# EAGLE design 6_Layer_sample (EAGLE 9.6.2)
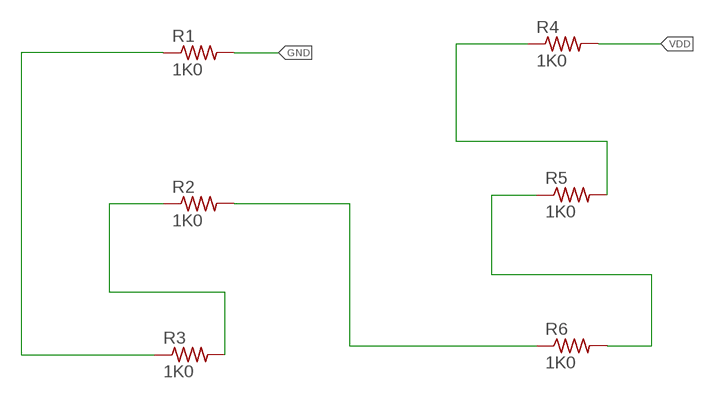
[diagram p0: schematic, sheet 1]

## Parts
R1  1K0  R_0402_1K0  [0402]
R2  1K0  R_0402_1K0  [0402]
R3  1K0  R_0402_1K0  [0402]
R4  1K0  R_0402_1K0  [0402]
R5  1K0  R_0402_1K0  [0402]
R6  1K0  R_0402_1K0  [0402]

## Nets
GND: R1.P$2
N$1: R1.P$1 R3.P$1
N$2: R2.P$1 R3.P$2
N$3: R2.P$2 R6.P$1
N$4: R5.P$1 R6.P$2
N$5: R4.P$1 R5.P$2
VDD: R4.P$2

## Library data of the parts
R1-R6 = 3D_MIG_Controller:R_0402_1K0; PARTNO: CRG0402J1K0

## Board
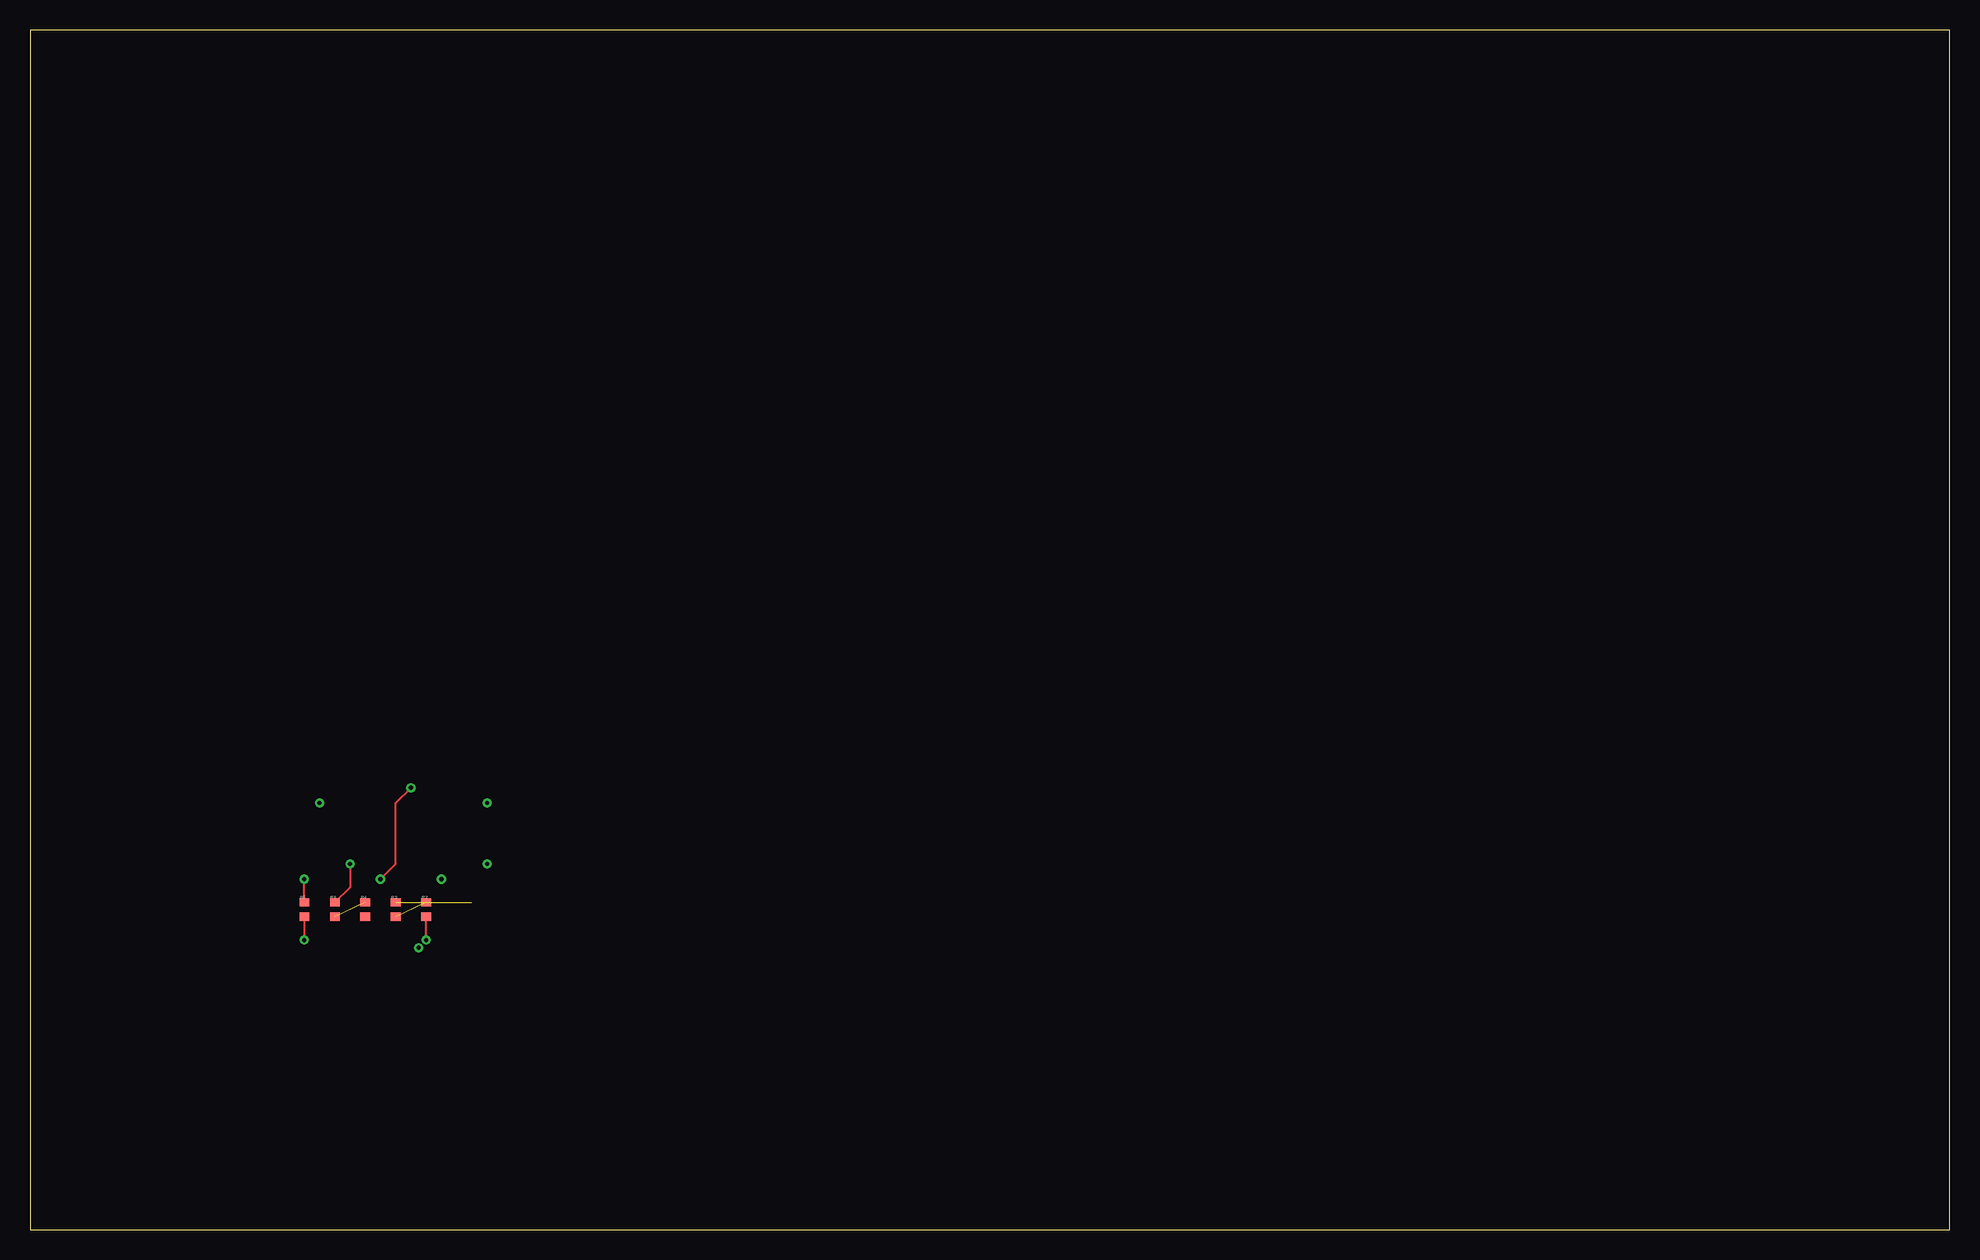
[diagram p1: board, top side]
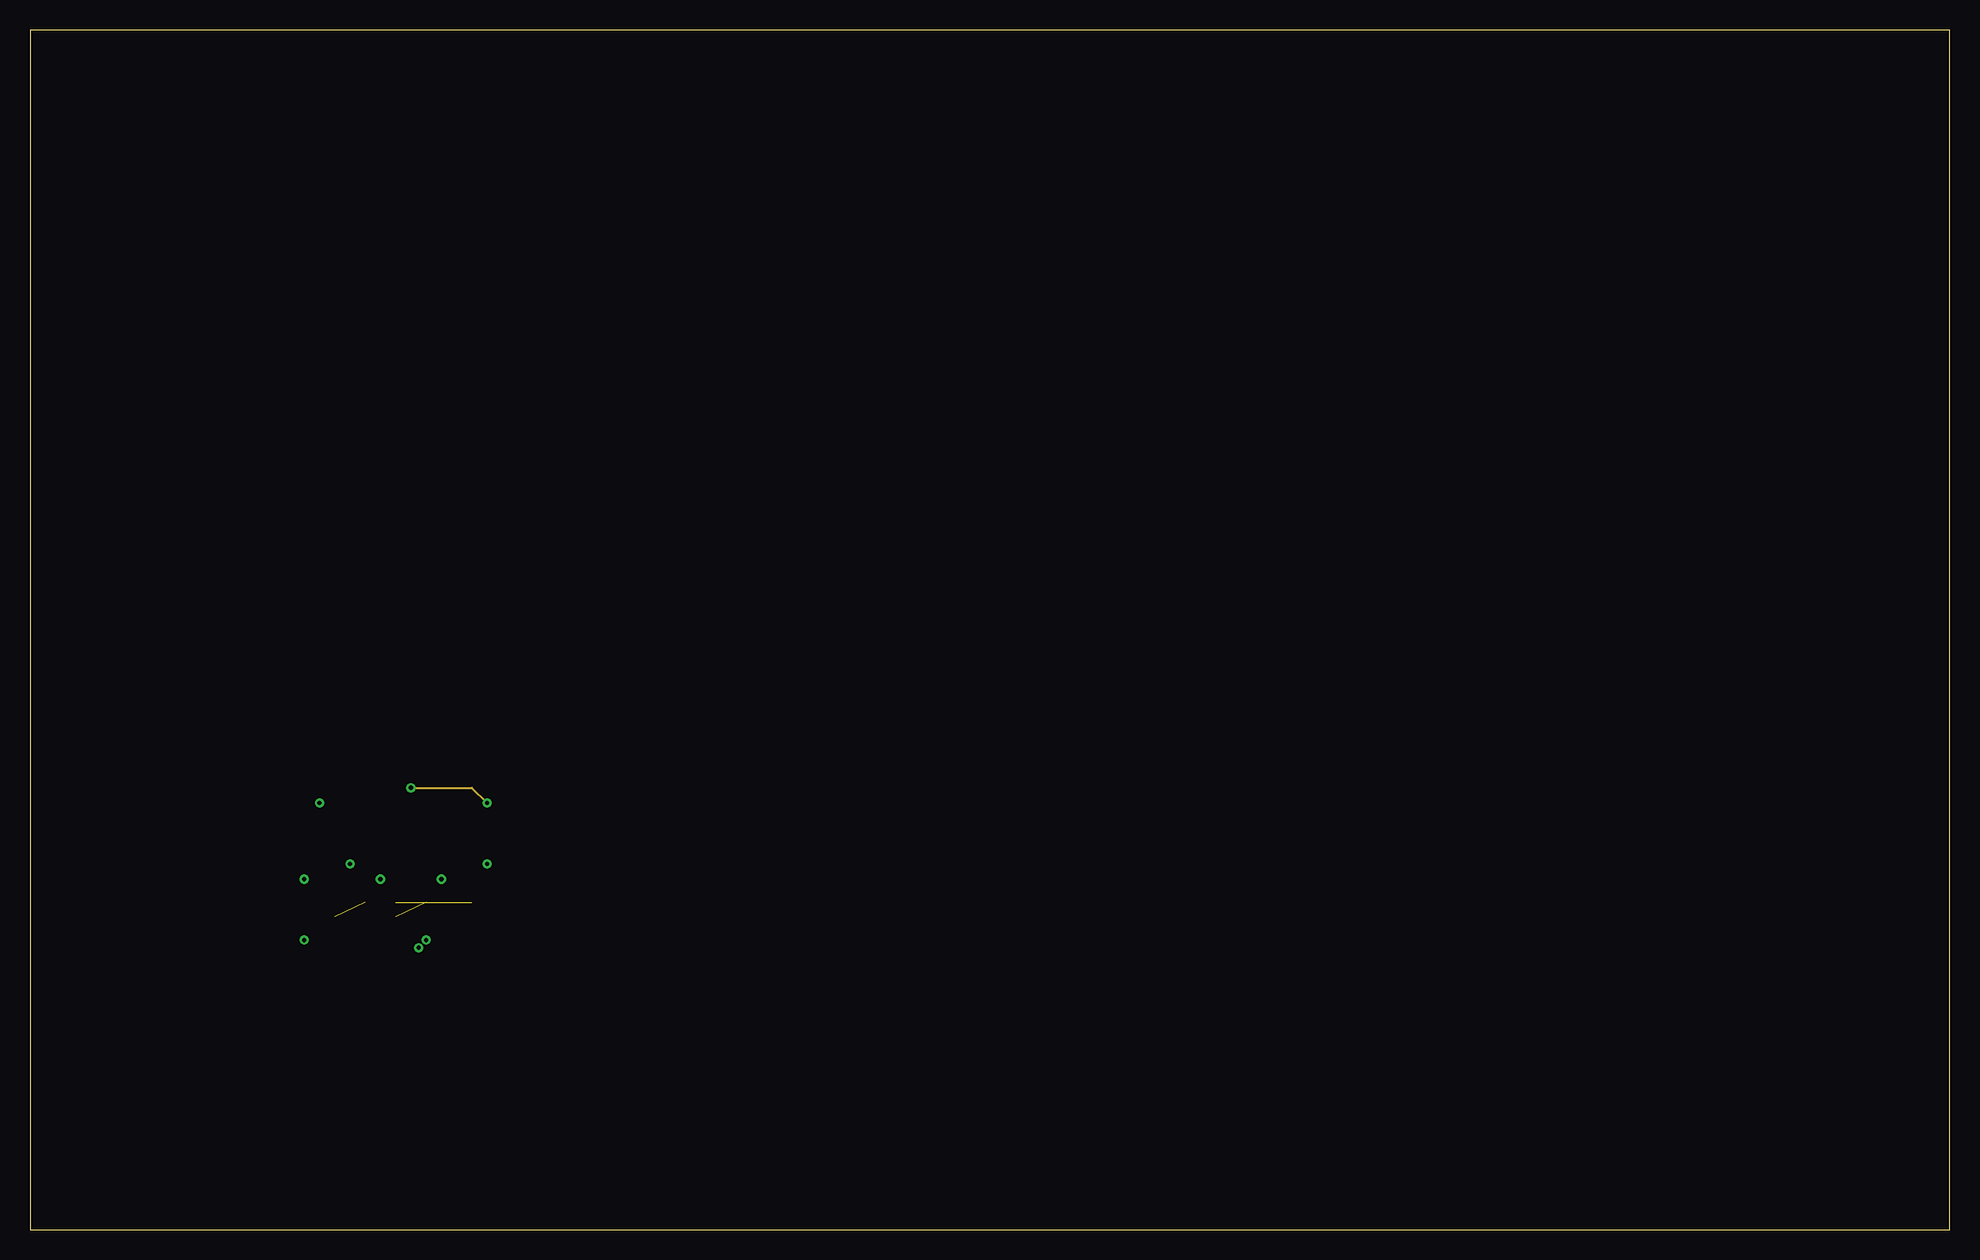
[diagram p2: board, inner layer Route2]
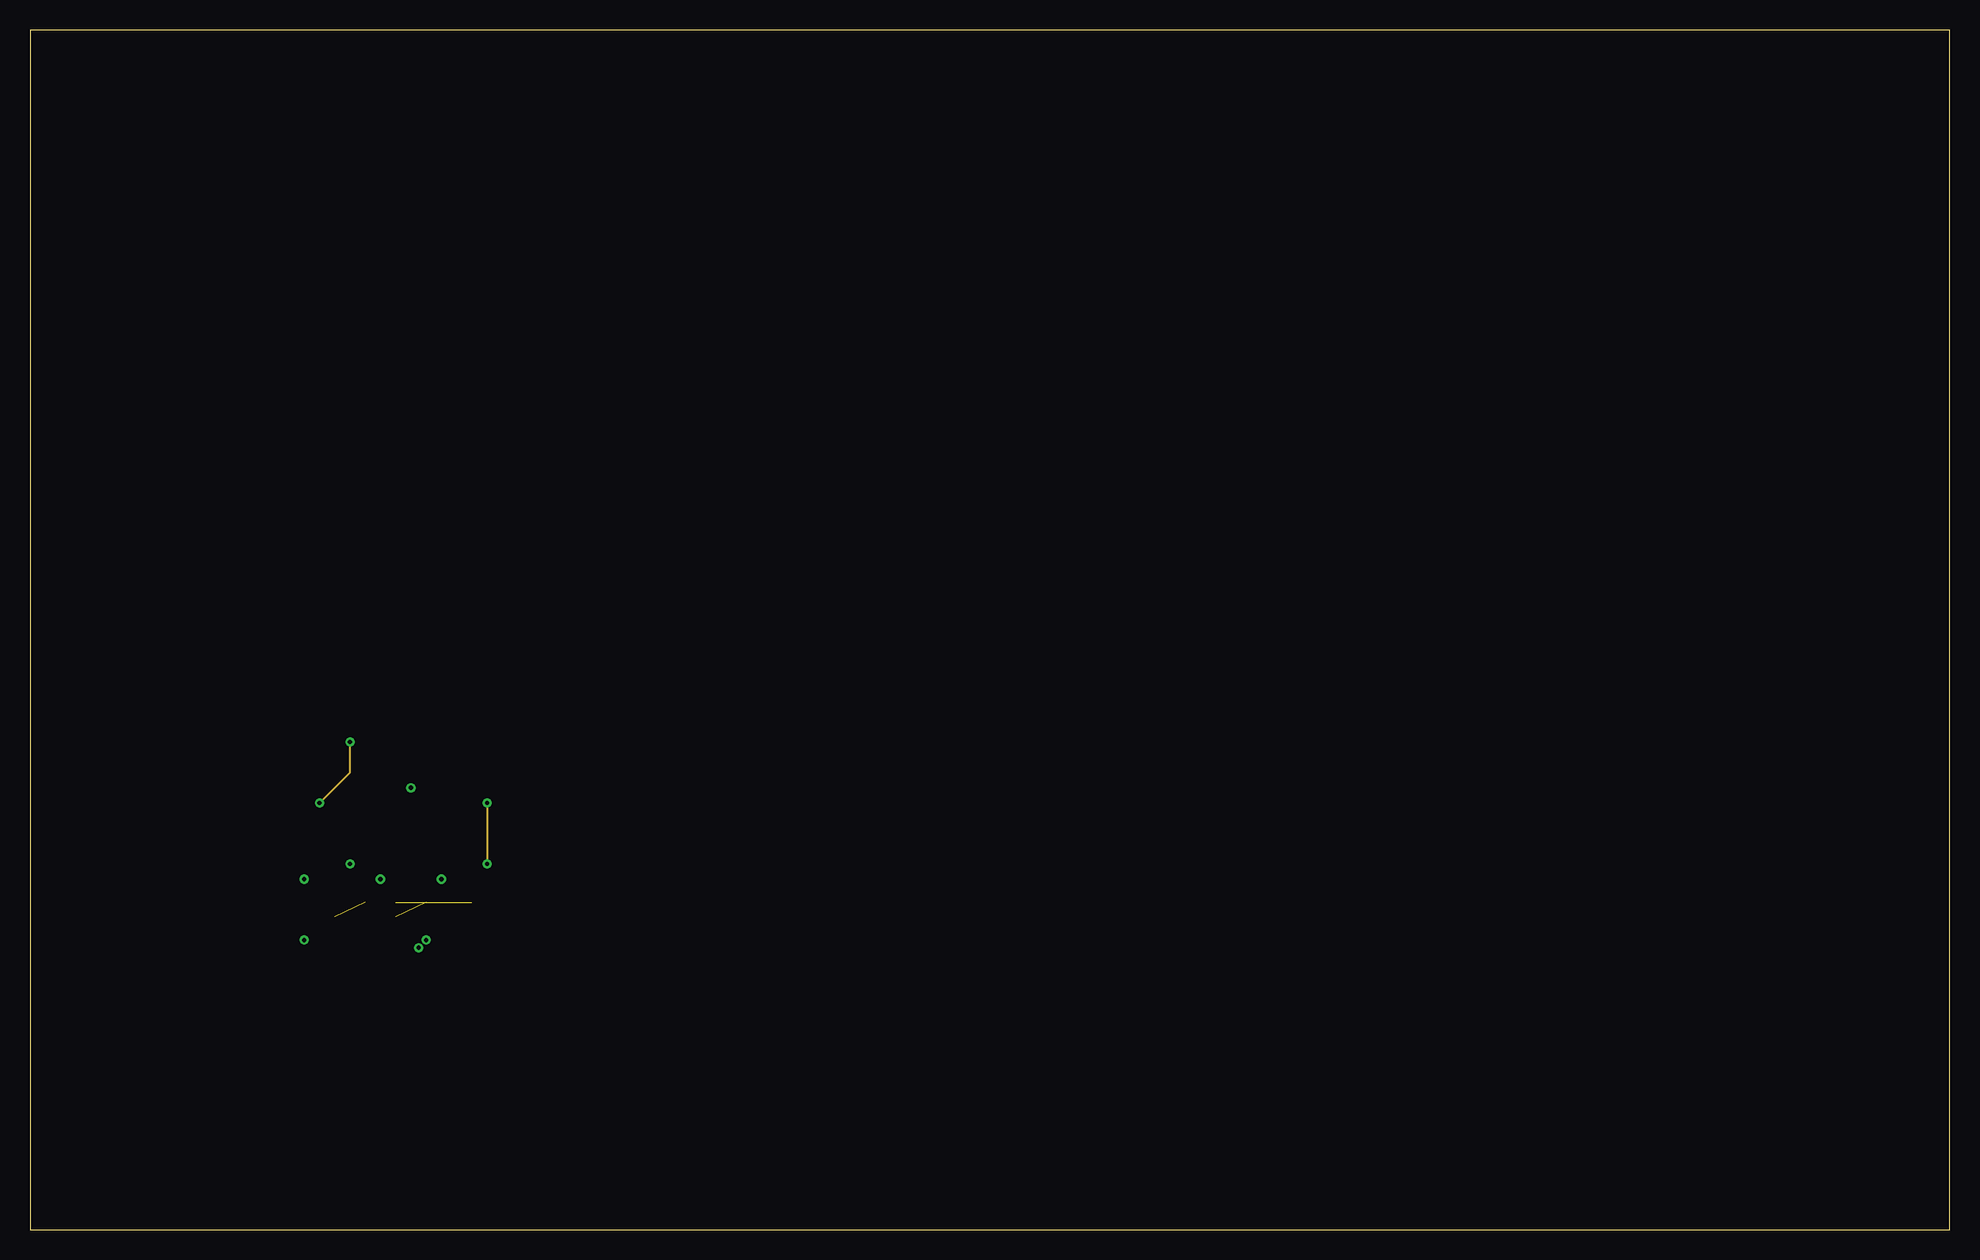
[diagram p3: board, inner layer Route3]
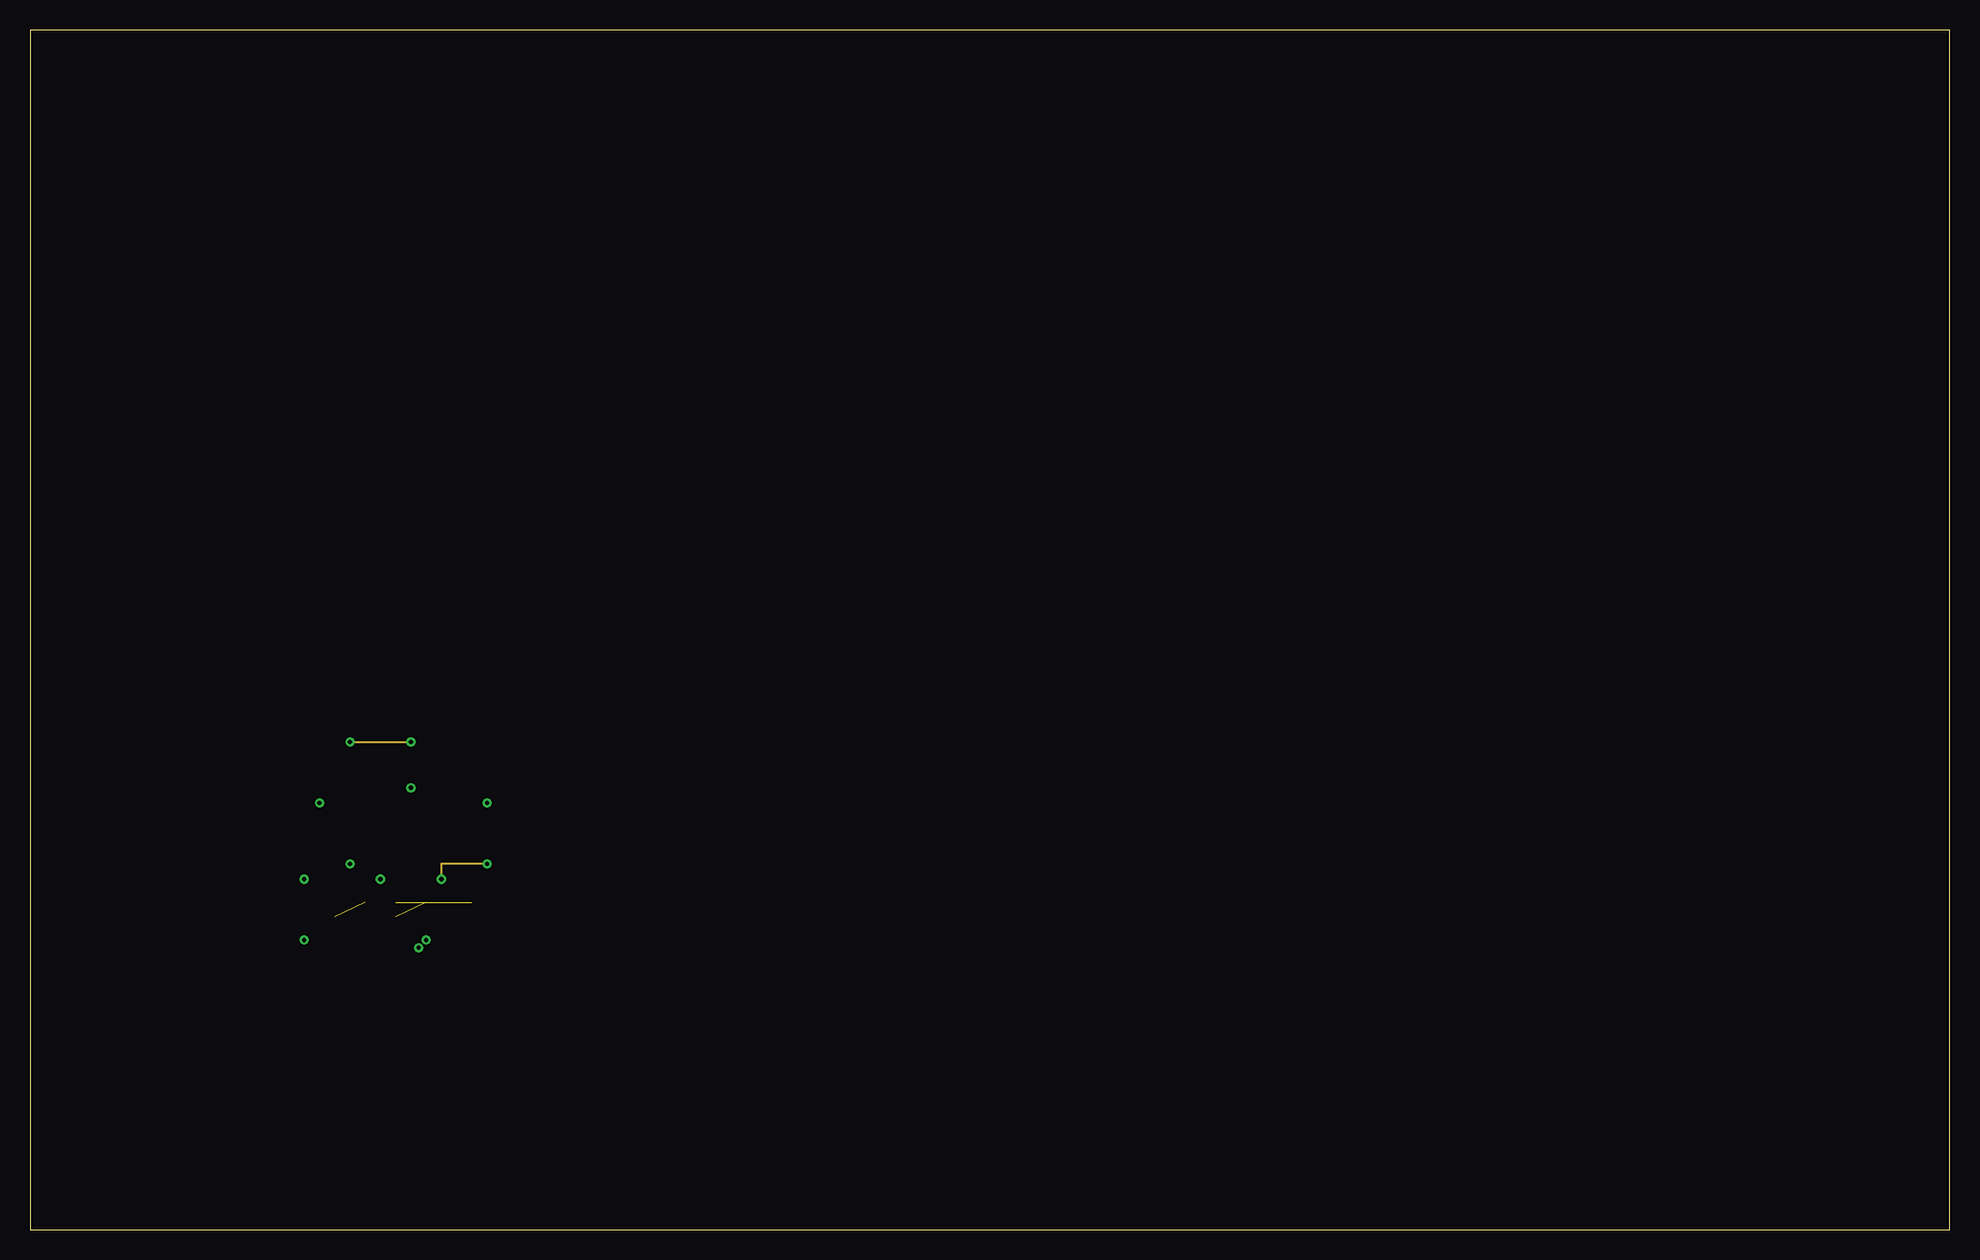
[diagram p4: board, inner layer Route14]
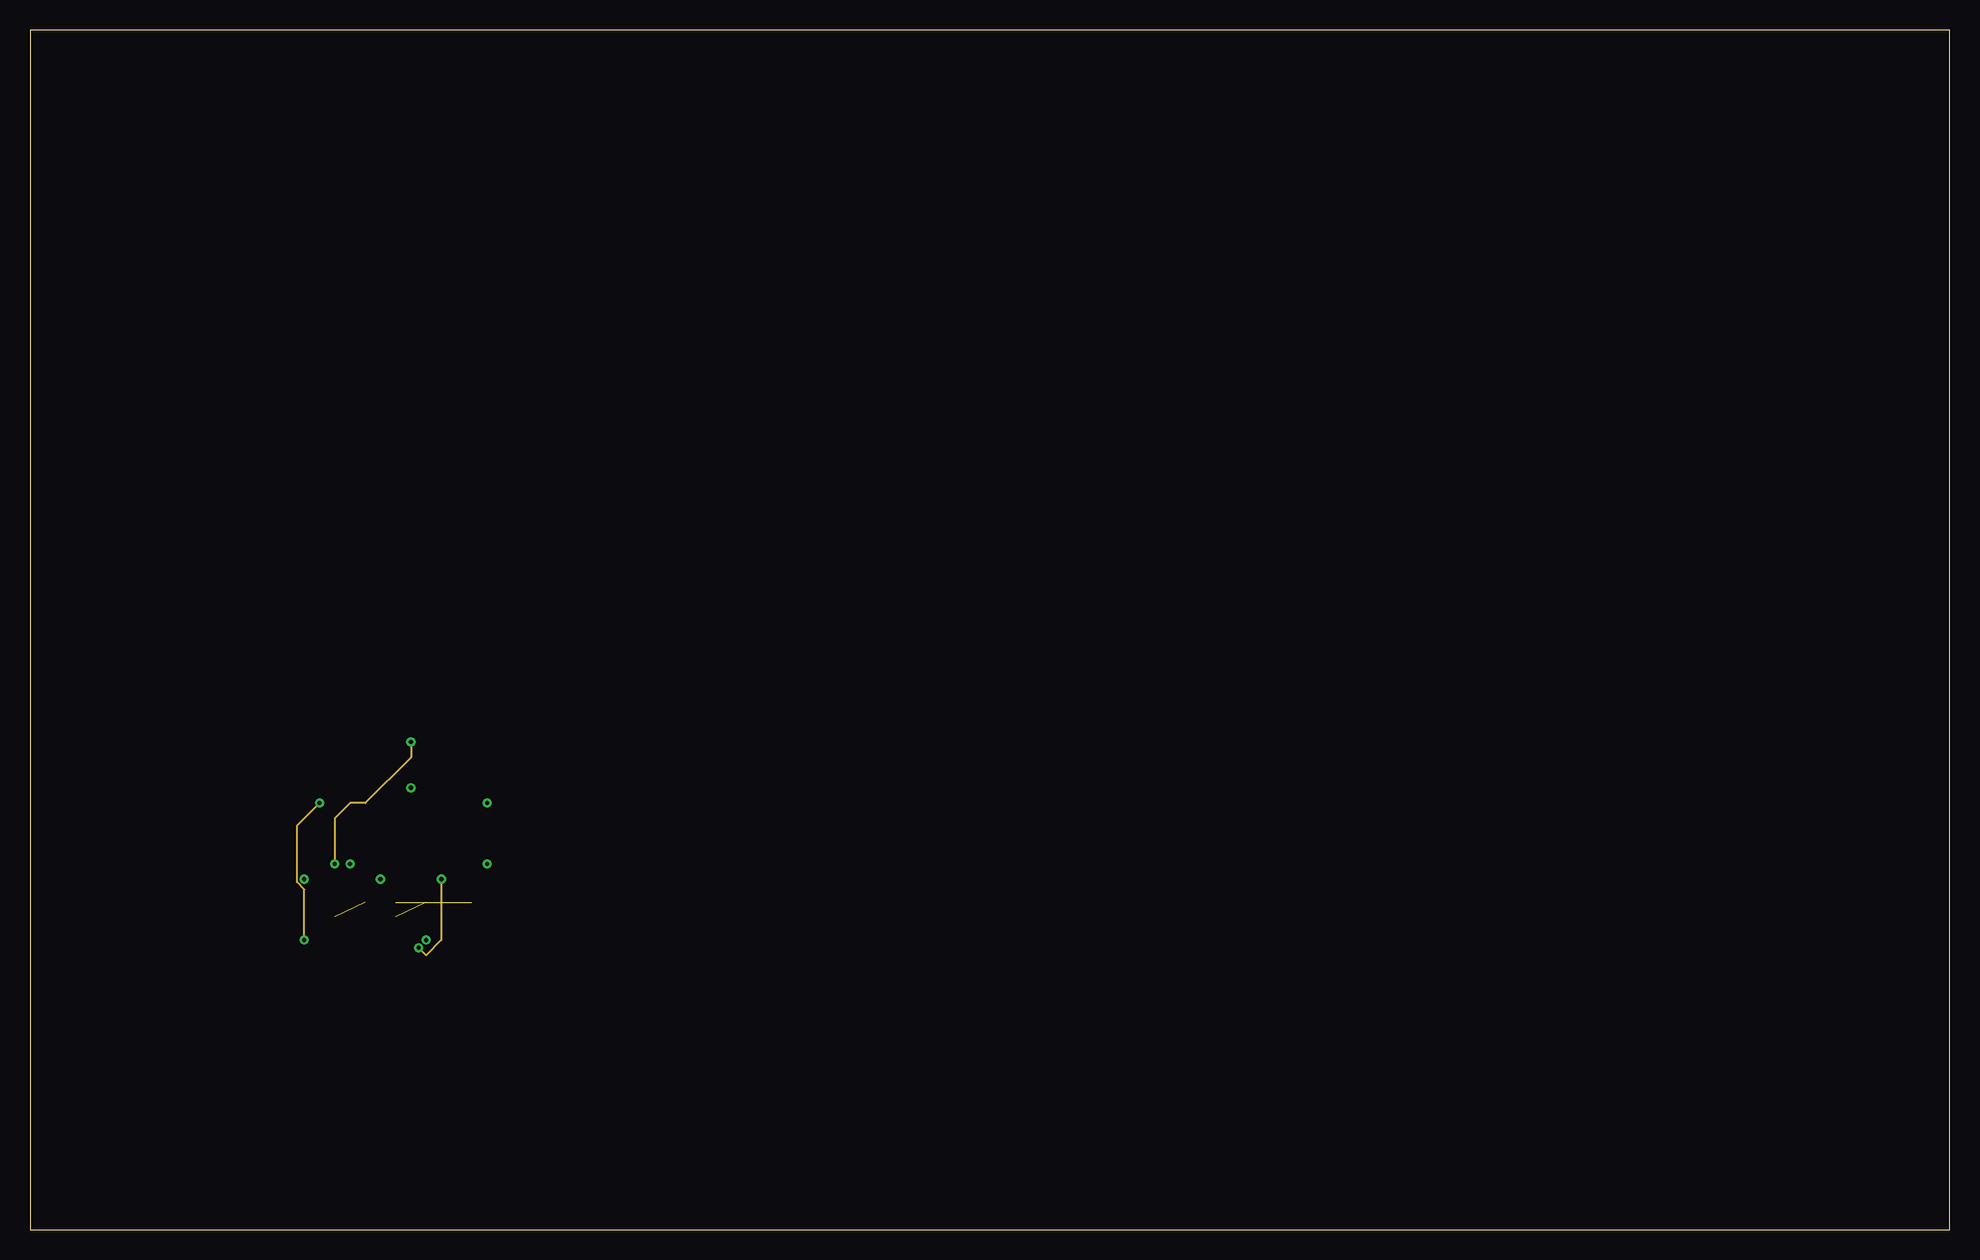
[diagram p5: board, inner layer Route15]
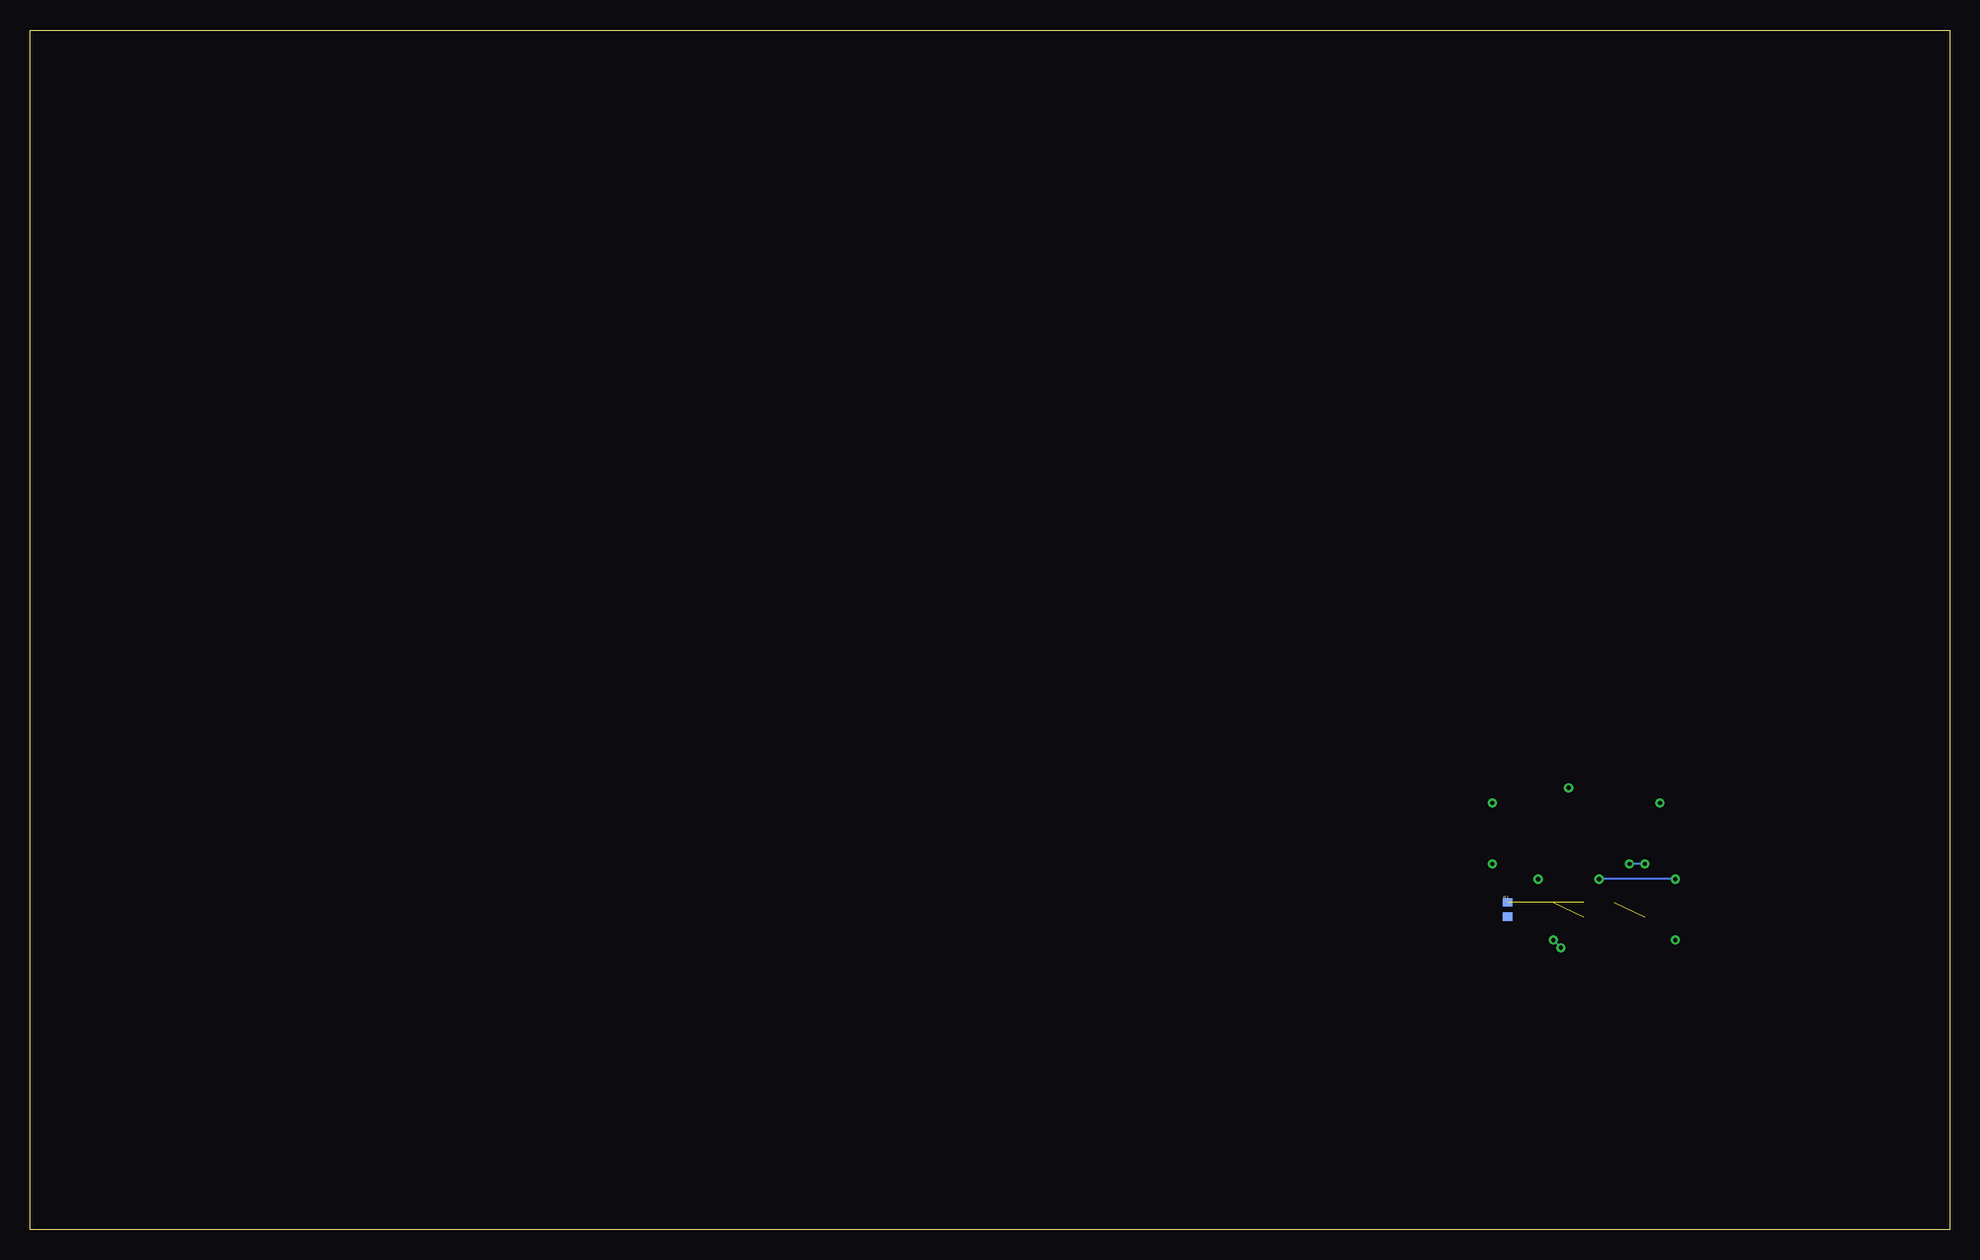
[diagram p6: board, bottom side, seen from below]

Size 160 x 100 mm. Coordinates in mm from the lower left corner, seen from the top.
Outline: 0,0 160,0 160,100 0,100 0,0
Copper layers ([2:1+[3:2*(3+14)*15:14]+16:15]): Top 0.035mm / dielectric 1.5mm / Route2 0.035mm / dielectric 0.15mm / Route3 0.035mm / dielectric 0.2mm / Route14 0.035mm / dielectric 0.15mm / Route15 0.035mm / dielectric 0.2mm / Bottom 0.035mm
Design rules "default *": minimum track width 6mil, minimum drill 0.35mm, track to track 6mil, track to pad 6mil, pad to pad 6mil, via to via 6mil, smd to smd 6mil, copper to edge 40mil, drill to drill 6mil, minimum pad ring 10mil, minimum via ring 8mil, stop-mask expansion 4mil, vias tented up to drill 0mil, thermal gap 10mil

### Footprints (pad centres in the part's own frame; a part is rotated, then mirrored left to right if it is on the bottom)
0402 = smd 0.8 x 0.7: P$1 0,0.6; P$2 0,-0.6

### Placement (x,y rotation side)
R1  36.83,26.67 0 bottom
R2  33.02,26.67 0 top
R3  30.48,26.67 0 top
R4  27.94,26.67 0 top
R5  25.4,26.67 0 top
R6  22.86,26.67 0 top

### Tracks (layer width: path | path; a pad name or v marks a point on that pad's centre or on a via)
N$1  (1 unrouted)
N$2  (1 unrouted)
N$3  (via drill 0.35)
  Top 0.152: R6.P$1 v22.86,29.21 | v29.21,29.21 30.48,30.48 30.48,35.56 v31.75,36.83 | v33.02,24.13 R2.P$2
  Route2 0.152: v38.1,35.56 36.83,36.83 v31.75,36.83
  Route3 0.152: v38.1,35.56 v38.1,30.48
  Route14 0.152: v38.1,30.48 34.29,30.48 v34.29,29.21
  Route15 0.152: v34.29,29.21 34.29,24.13 33.02,22.86 v32.38,23.5
  Bottom 0.152: v22.86,29.21 v29.21,29.21 | v32.38,23.5 v33.02,24.13
N$4  (via drill 0.35, 0.35 layers 14-15, 0.35 layers 15-16, 0.35 layers 3-14)
  Top 0.152: R6.P$2 v22.86,24.13 | v26.67,30.48 26.67,28.54 R5.P$1
  Route3 0.152: v24.13,35.56 26.67,38.1 v26.67,40.64
  Route14 0.152: v26.67,40.64 v31.75,40.64
  Route15 0.152: v22.86,24.13 22.86,28.35 22.25,28.96 22.25,33.68 v24.13,35.56 | v31.75,40.64 31.75,39.37 27.94,35.56 26.67,35.56 25.4,34.29 v25.4,30.48
  Bottom 0.152: v25.4,30.48 v26.67,30.48
N$5  (1 unrouted)